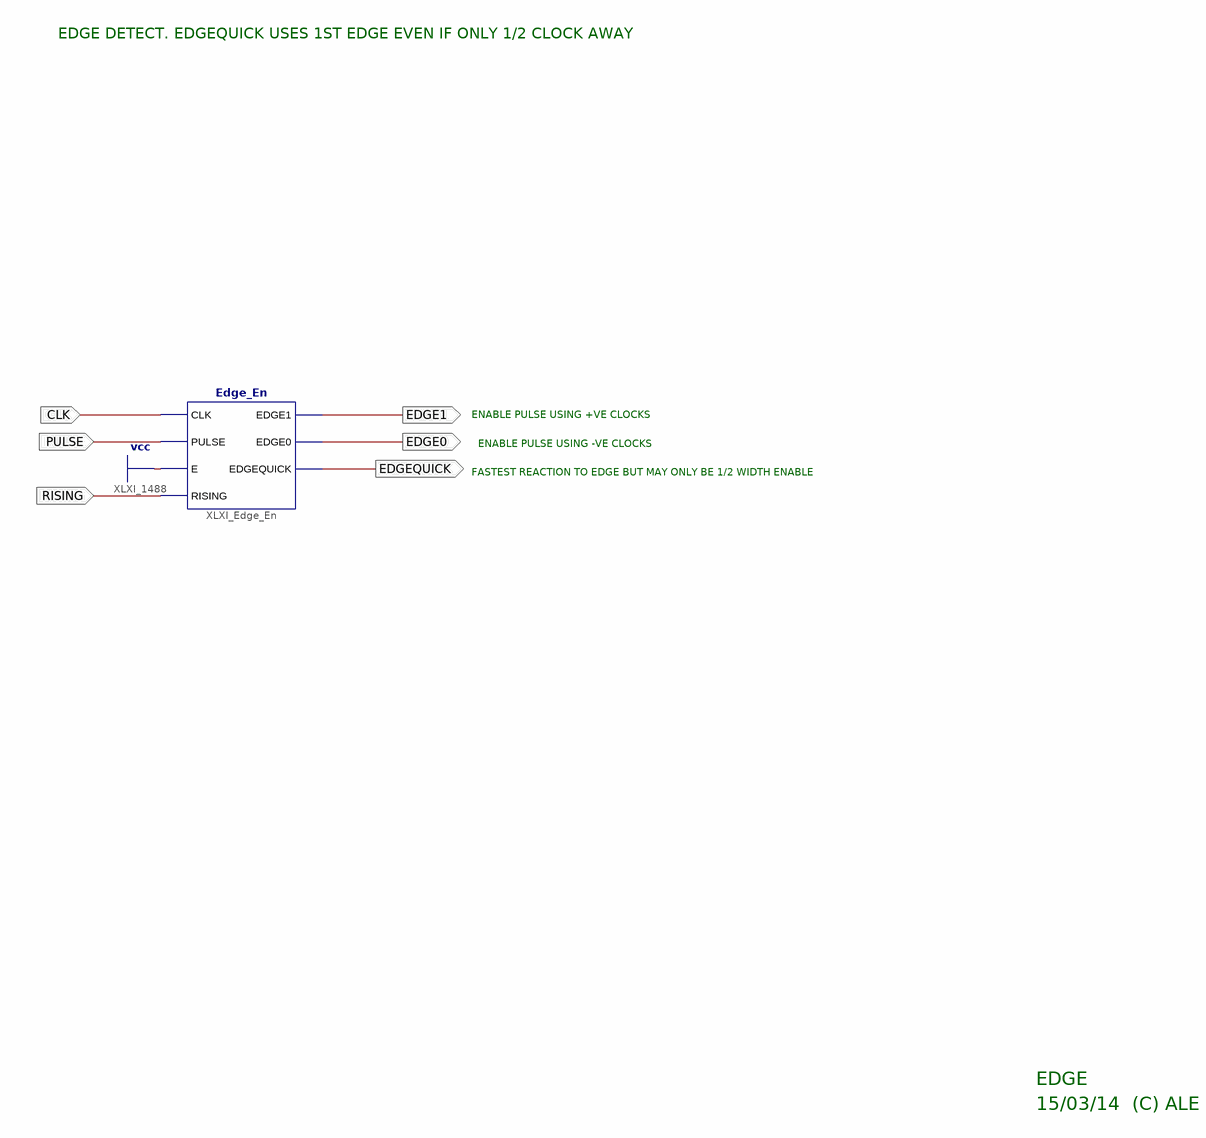
[diagram p0: schematic sheet 1]
// Xilinx ISE schematic Edge.sch (spartan3e) as structural Verilog: 1 symbols, 6 ports
module Edge (
  input  RISING,
  input  PULSE,
  input  CLK,
  output EDGEQUICK,
  output EDGE1,
  output EDGE0
);

  Edge_En XLXI_Edge_En (
    .CLK(CLK), .E(1'b1), .EDGE0(EDGE0), .EDGE1(EDGE1), .EDGEQUICK(EDGEQUICK), .PULSE(PULSE), .RISING(RISING));

  // Notes on the sheet:
  //   EDGE DETECT. EDGEQUICK USES 1ST EDGE EVEN IF ONLY 1/2 CLOCK AWAY
  //   ENABLE PULSE USING +VE CLOCKS
  //   ENABLE PULSE USING -VE CLOCKS
  //   FASTEST REACTION TO EDGE BUT MAY ONLY BE 1/2 WIDTH ENABLE
  //   EDGE
  //   15/03/14  (C) ALE
endmodule
